# EAGLE design DTUnodeSchematic (EAGLE 8.0.0)

## Sheet 1 of 4
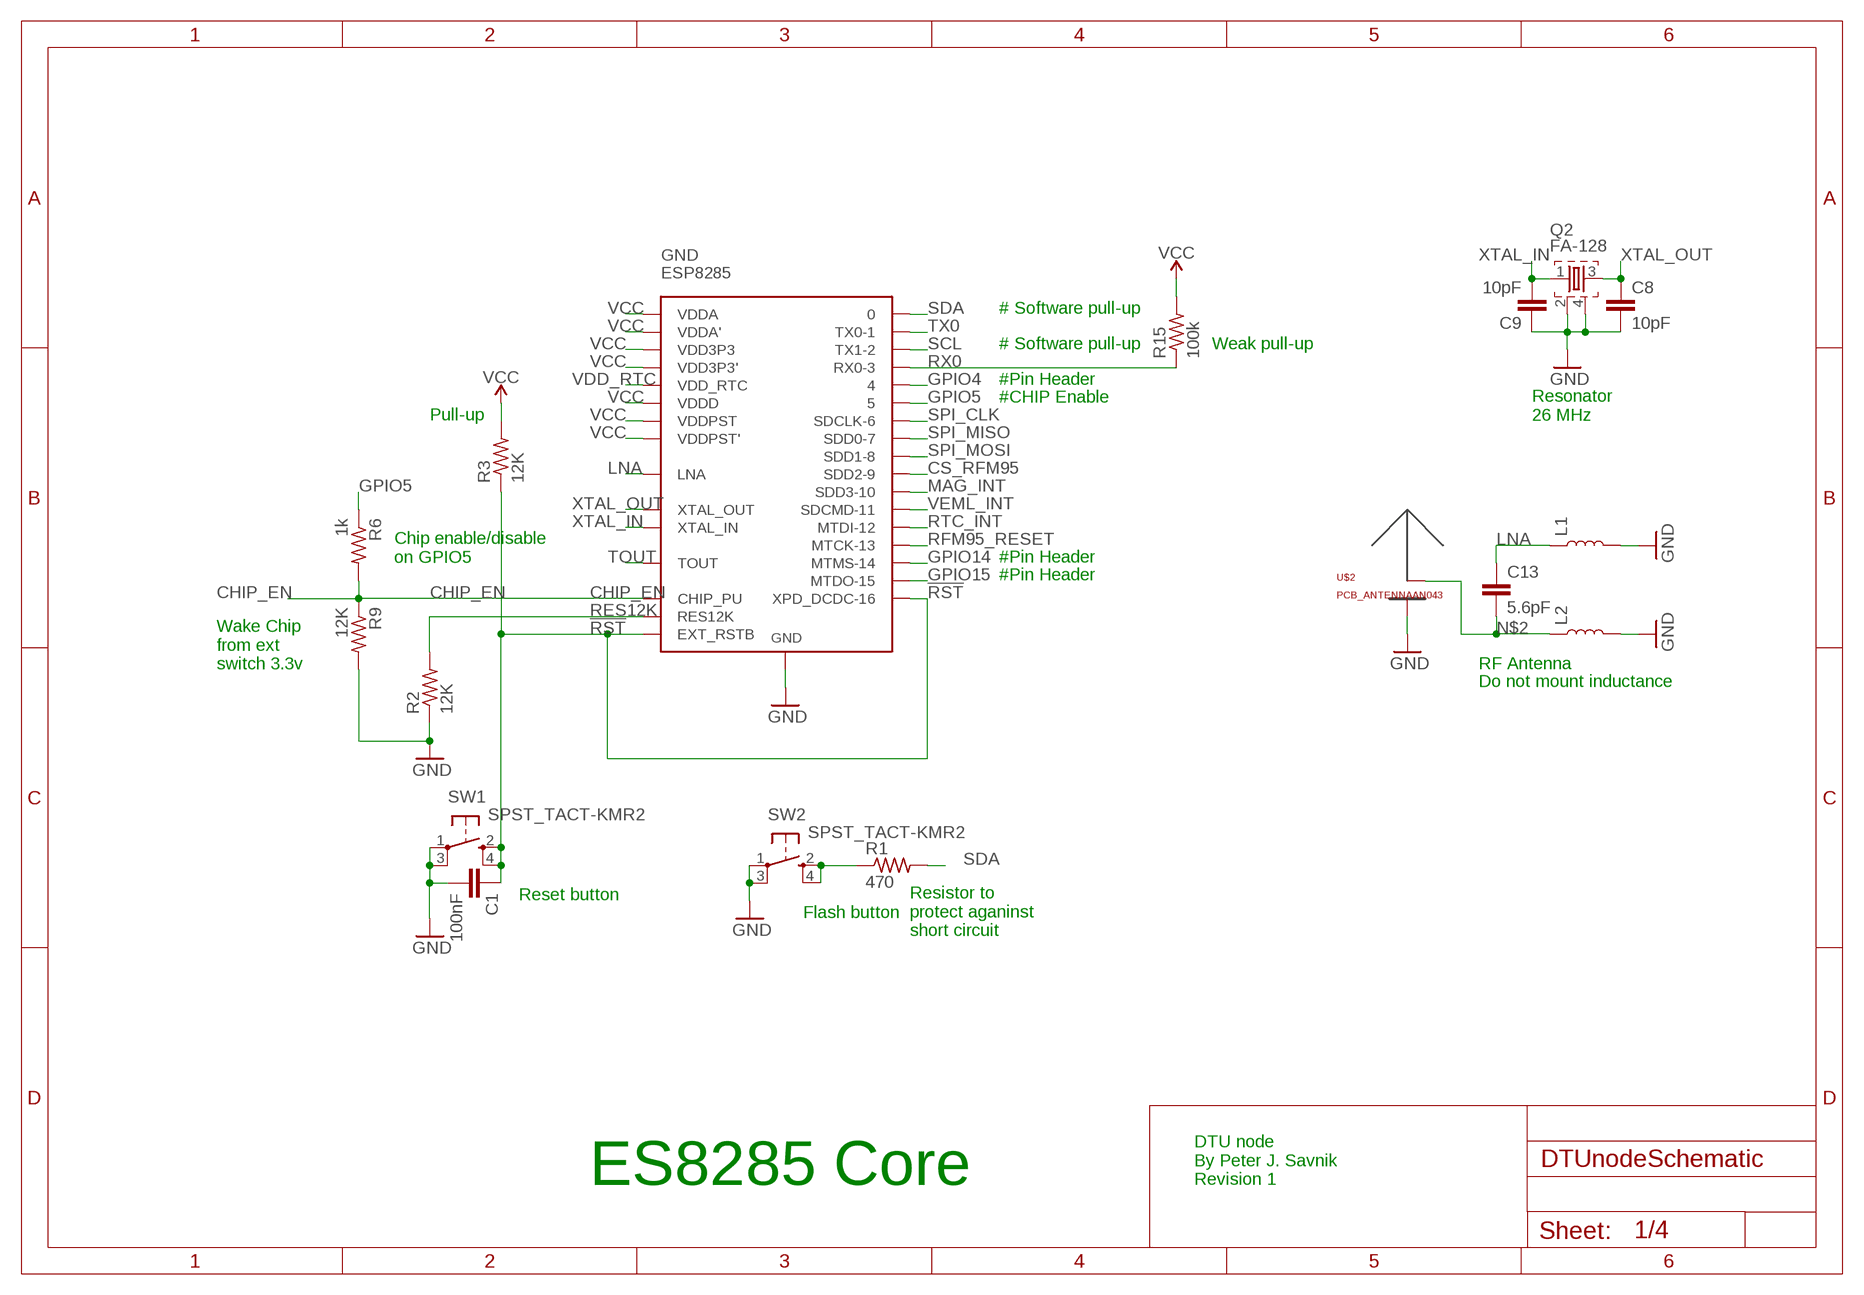
[diagram p0: schematic, sheet 1]

### Parts
C1  100nF  C-EUC0402K  [C0402K]
C8  10pF  C-EUC0402K  [C0402K]
C9  10pF  C-EUC0402K  [C0402K]
C13  5.6pF  C-EUC0402K  [C0402K]
GND  ESP8285  [QFN-32]
L1  INDUCTOR-0402-3.9NH  [0402]
L2  INDUCTOR-0402-3.9NH  [0402]
Q2  FA-128  [FA-128]
R1  470  R-US_R0402  [R0402]
R2  12K  R-US_R0402  [R0402]
R3  12K  R-US_R0402  [R0402]
R6  1k  R-US_R0402  [R0402]
R9  12K  R-US_R0402  [R0402]
R15  100k  R-US_R0402  [R0402]
SW1  SPST_TACT-KMR2  [KMR2]
SW2  SPST_TACT-KMR2  [KMR2]
U$2  PCB_ANTENNAAN043  [PCB_ANTENNA_TI-AN043]

### Nets
!RST: C1.1 GND.P$8(XPD_DCDC-16) GND.P$32(EXT_RSTB) R3.1 SW1.2(S) SW1.4(S1) ; also sheet 3
CHIP_EN: GND.P$7(CHIP_PU) R6.2 R9.1 ; also sheet 4
CS_RFM95: GND.P$18(SDD2-9) ; also sheet 3
GND: C1.2 C8.2 C9.1 GND.33-GND(GND) L1.2 L2.2 Q2.2 Q2.4 R2.1 R9.2 SW1.1(P) SW1.3(P1) SW2.1(P) SW2.3(P1) U$2.GND ; also sheet 2,3,4
GPIO4: GND.P$16 ; also sheet 4
GPIO5: GND.P$24 R6.1
GPIO14: GND.P$9(MTMS-14) ; also sheet 4
GPIO15: GND.P$13(MTDO-15) ; also sheet 4
LNA: C13.1 GND.P$2(LNA) L1.1
MAG_INT: GND.P$19(SDD3-10) ; also sheet 3
N$1: R1.1 SW2.2(S) SW2.4(S1)
N$2: C13.2 L2.1 U$2.ANT(AND)
RES12K: GND.P$31(RES12K) R2.2
RFM95_RESET: GND.P$12(MTCK-13) ; also sheet 3
RTC_INT: GND.P$10(MTDI-12) ; also sheet 3
RX0: GND.P$25(RX0-3) R15.1 ; also sheet 4
SCL: GND.P$14(TX1-2) ; also sheet 3,4
SDA: GND.P$15 R1.2 ; also sheet 3,4
SPI_CLK: GND.P$21(SDCLK-6) ; also sheet 3
SPI_MISO: GND.P$22(SDD0-7) ; also sheet 3
SPI_MOSI: GND.P$23(SDD1-8) ; also sheet 3
TOUT: GND.P$6(TOUT) ; also sheet 2
TX0: GND.P$26(TX0-1) ; also sheet 4
VCC: GND.P$1(VDDA) GND.P$3(VDD3P3) GND.P$4(VDD3P3') GND.P$11(VDDPST) GND.P$17(VDDPST') GND.P$29(VDDD) GND.P$30(VDDA') R3.2 R15.2 ; also sheet 2,3,4
VDD_RTC: GND.P$5(VDD_RTC)
VEML_INT: GND.P$20(SDCMD-11) ; also sheet 3
XTAL_IN: C9.2 GND.P$28(XTAL_IN) Q2.1
XTAL_OUT: C8.1 GND.P$27(XTAL_OUT) Q2.3

### Notes on the sheet
- # Software pull-up
- # Software pull-up | Weak pull-up
- #Pin Header
- #CHIP Enable
- Pull-up
- Resonator
  26 MHz
- Chip enable/disable
  on GPIO5
- #Pin Header
- #Pin Header
- Wake Chip 
  from ext
  switch 3.3v
- RF Antenna
- Do not mount inductance
- Reset button
- Flash button
- Resistor to 
  protect aganinst
  short circuit
- ES8285 Core
- DTU node
  By Peter J. Savnik
  Revision 1

## Sheet 2 of 4
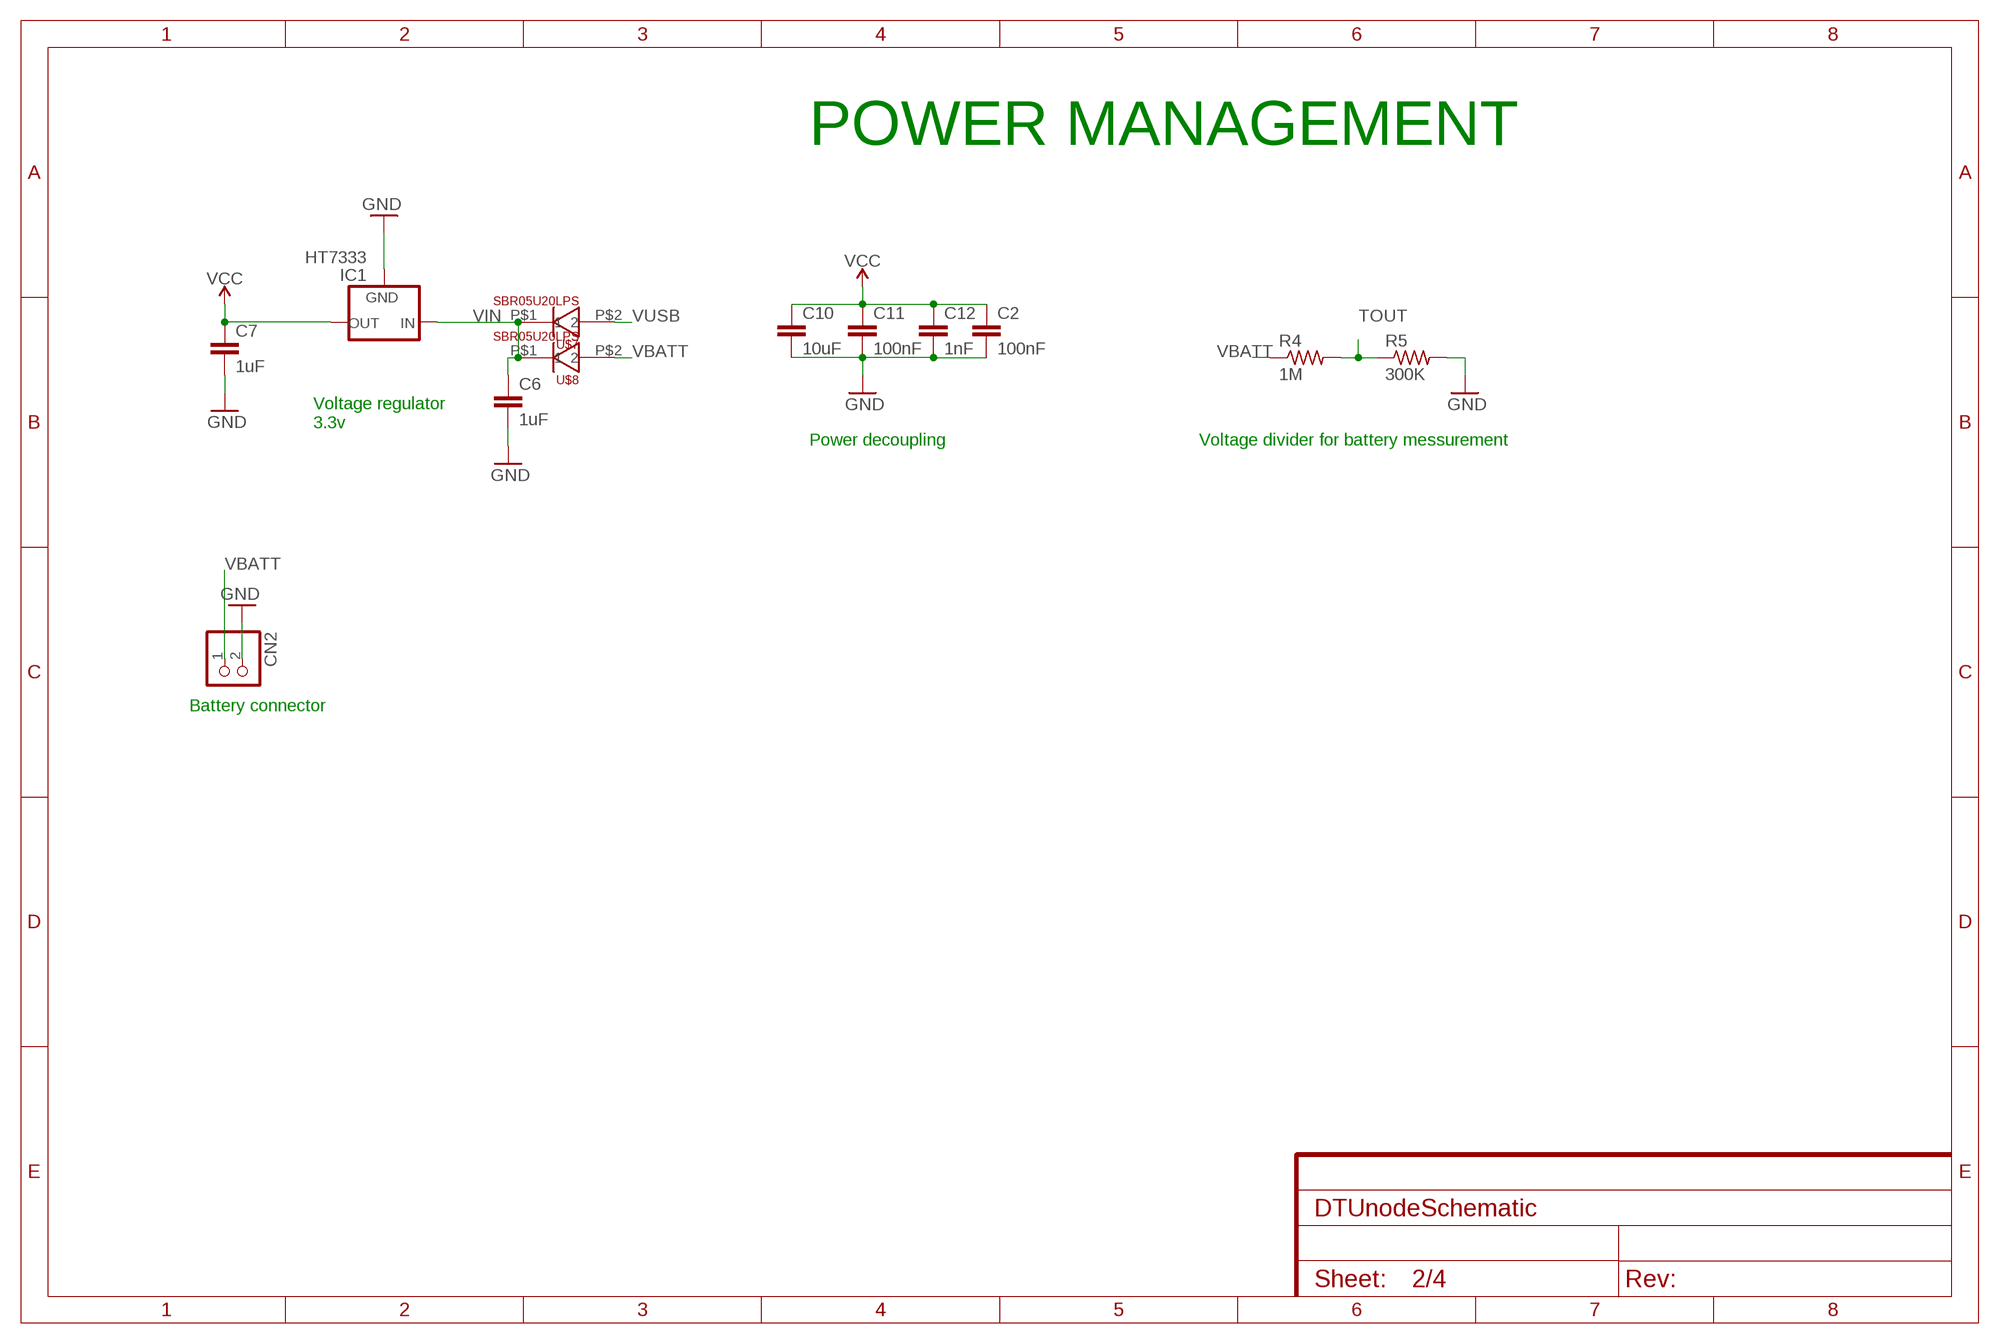
[diagram p1: schematic, sheet 2]

### Parts
C2  100nF  C-EUC0402K  [C0402K]
C6  1uF  C-EUC0402K  [C0402K]
C7  1uF  C-EUC0402K  [C0402K]
C10  10uF  C-EUC0402K  [C0402K]
C11  100nF  C-EUC0402K  [C0402K]
C12  1nF  C-EUC0402K  [C0402K]
CN2  JST_2PIN-THM-RA  [JST-PH-2-THM-RA]
IC1  HT7333  [SOT-89]
R4  1M  R-US_R0402  [R0402]
R5  300K  R-US_R0402  [R0402]
U$7  SBR05U20LPS  [X2-DFN1006-2]
U$8  SBR05U20LPS  [X2-DFN1006-2]

### Nets
GND: C2.2 C6.2 C7.2 C10.2 C11.2 C12.2 CN2.2 IC1.2(GND) R5.2 ; also sheet 1,3,4
TOUT: R4.2 R5.1 ; also sheet 1
VBATT: CN2.1 R4.1 U$8.P$2 ; also sheet 4
VCC: C2.1 C7.1 C10.1 C11.1 C12.1 IC1.1(OUT) ; also sheet 1,3,4
VIN: C6.1 IC1.3(IN) IC1.4(IN) U$7.P$1 U$8.P$1
VUSB: U$7.P$2 ; also sheet 4

### Notes on the sheet
- POWER MANAGEMENT
- Voltage regulator
  3.3v
- Power decoupling | Voltage divider for battery messurement
- Battery connector

## Sheet 3 of 4
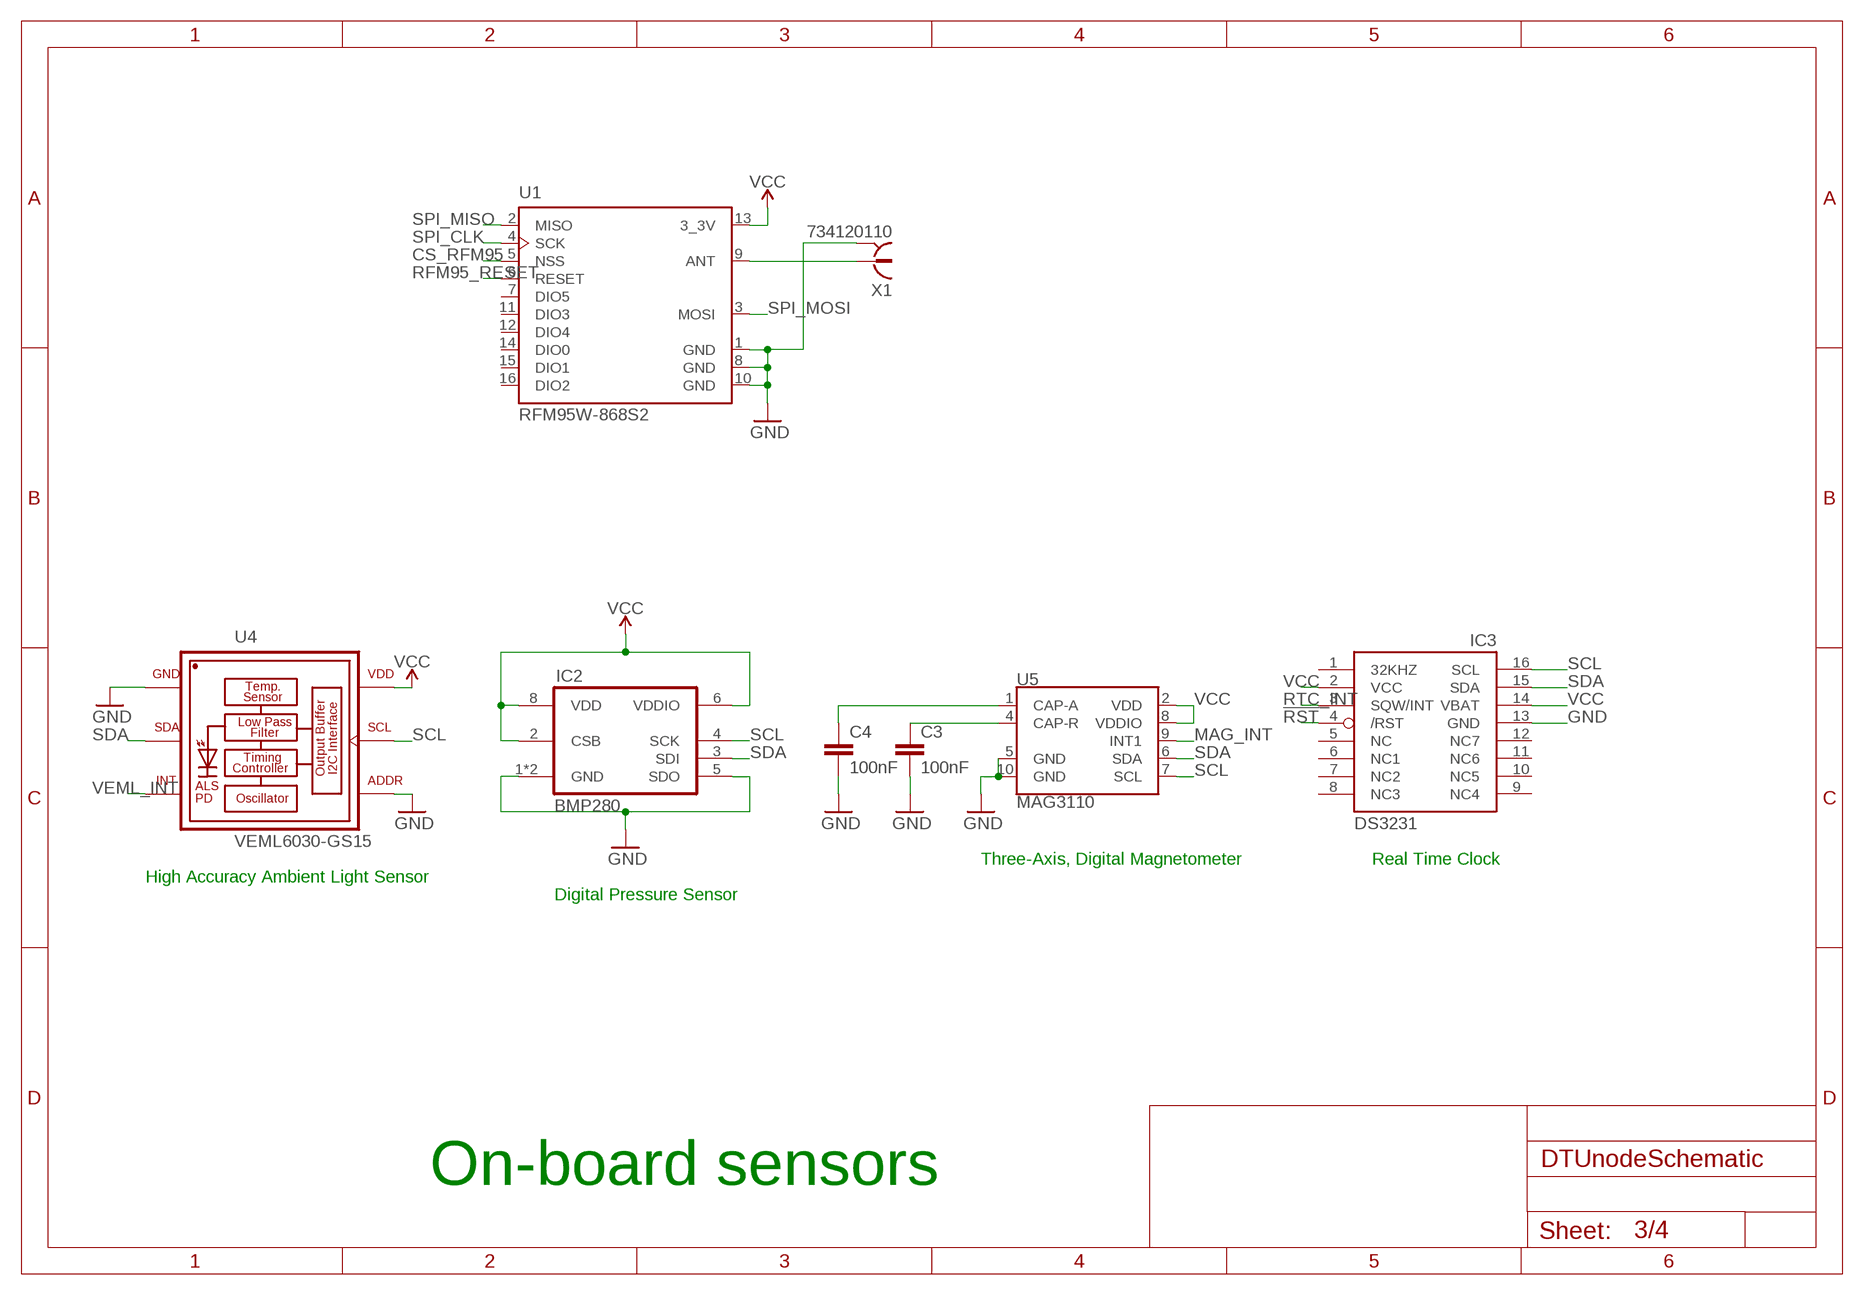
[diagram p2: schematic, sheet 3]

### Parts
C3  100nF  C-EUC0402  [C0402]
C4  100nF  C-EUC0402  [C0402]
IC2  BMP280  [BMP280]
IC3  DS3231/SO  [SO16W]
U1  RFM95W-868S2  [XCVR_RFM95W-868S2]
U4  VEML6030-GS15  [VISHAY_VEML6030_2X2X0.87]
U5  MAG3110  [DFN-10]
X1  734120110  [734120110]

### Nets
!RST: IC3.4(/RST) ; also sheet 1
CS_RFM95: U1.5(NSS) ; also sheet 1
GND: C3.2 C4.2 IC2.1(GND) IC2.5(SDO) IC2.7(GND) IC3.13(GND) U1.1(GND) U1.8(GND) U1.10(GND) U4.1(GND) U4.4(ADDR) U5.5(GND) U5.10(GND) X1.S@1 X1.S@2 X1.S@3 ; also sheet 1,2,4
MAG_INT: U5.9(INT1) ; also sheet 1
N$3: U1.9(ANT) X1.1
N$9: C3.1 U5.4(CAP-R)
N$10: C4.1 U5.1(CAP-A)
RFM95_RESET: U1.6(RESET) ; also sheet 1
RTC_INT: IC3.3(SQW/INT) ; also sheet 1
SCL: IC2.4(SCK) IC3.16(SCL) U4.5(SCL) U5.7(SCL) ; also sheet 1,4
SDA: IC2.3(SDI) IC3.15(SDA) U4.2(SDA) U5.6(SDA) ; also sheet 1,4
SPI_CLK: U1.4(SCK) ; also sheet 1
SPI_MISO: U1.2(MISO) ; also sheet 1
SPI_MOSI: U1.3(MOSI) ; also sheet 1
VCC: IC2.2(CSB) IC2.6(VDDIO) IC2.8(VDD) IC3.2(VCC) IC3.14(VBAT) U1.13(3_3V) U4.6(VDD) U5.2(VDD) U5.8(VDDIO) ; also sheet 1,2,4
VEML_INT: U4.3(INT) ; also sheet 1
Unconnected: IC3.1(32KHZ) IC3.5(NC) IC3.6(NC1) IC3.7(NC2) IC3.8(NC3) IC3.9(NC4) IC3.10(NC5) IC3.11(NC6) IC3.12(NC7) U1.7(DIO5) U1.11(DIO3) U1.12(DIO4) U1.14(DIO0) U1.15(DIO1) U1.16(DIO2)

### Notes on the sheet
- Three-Axis, Digital Magnetometer | Real Time Clock
- High Accuracy Ambient Light Sensor
- Digital Pressure Sensor
- On-board sensors

## Sheet 4 of 4
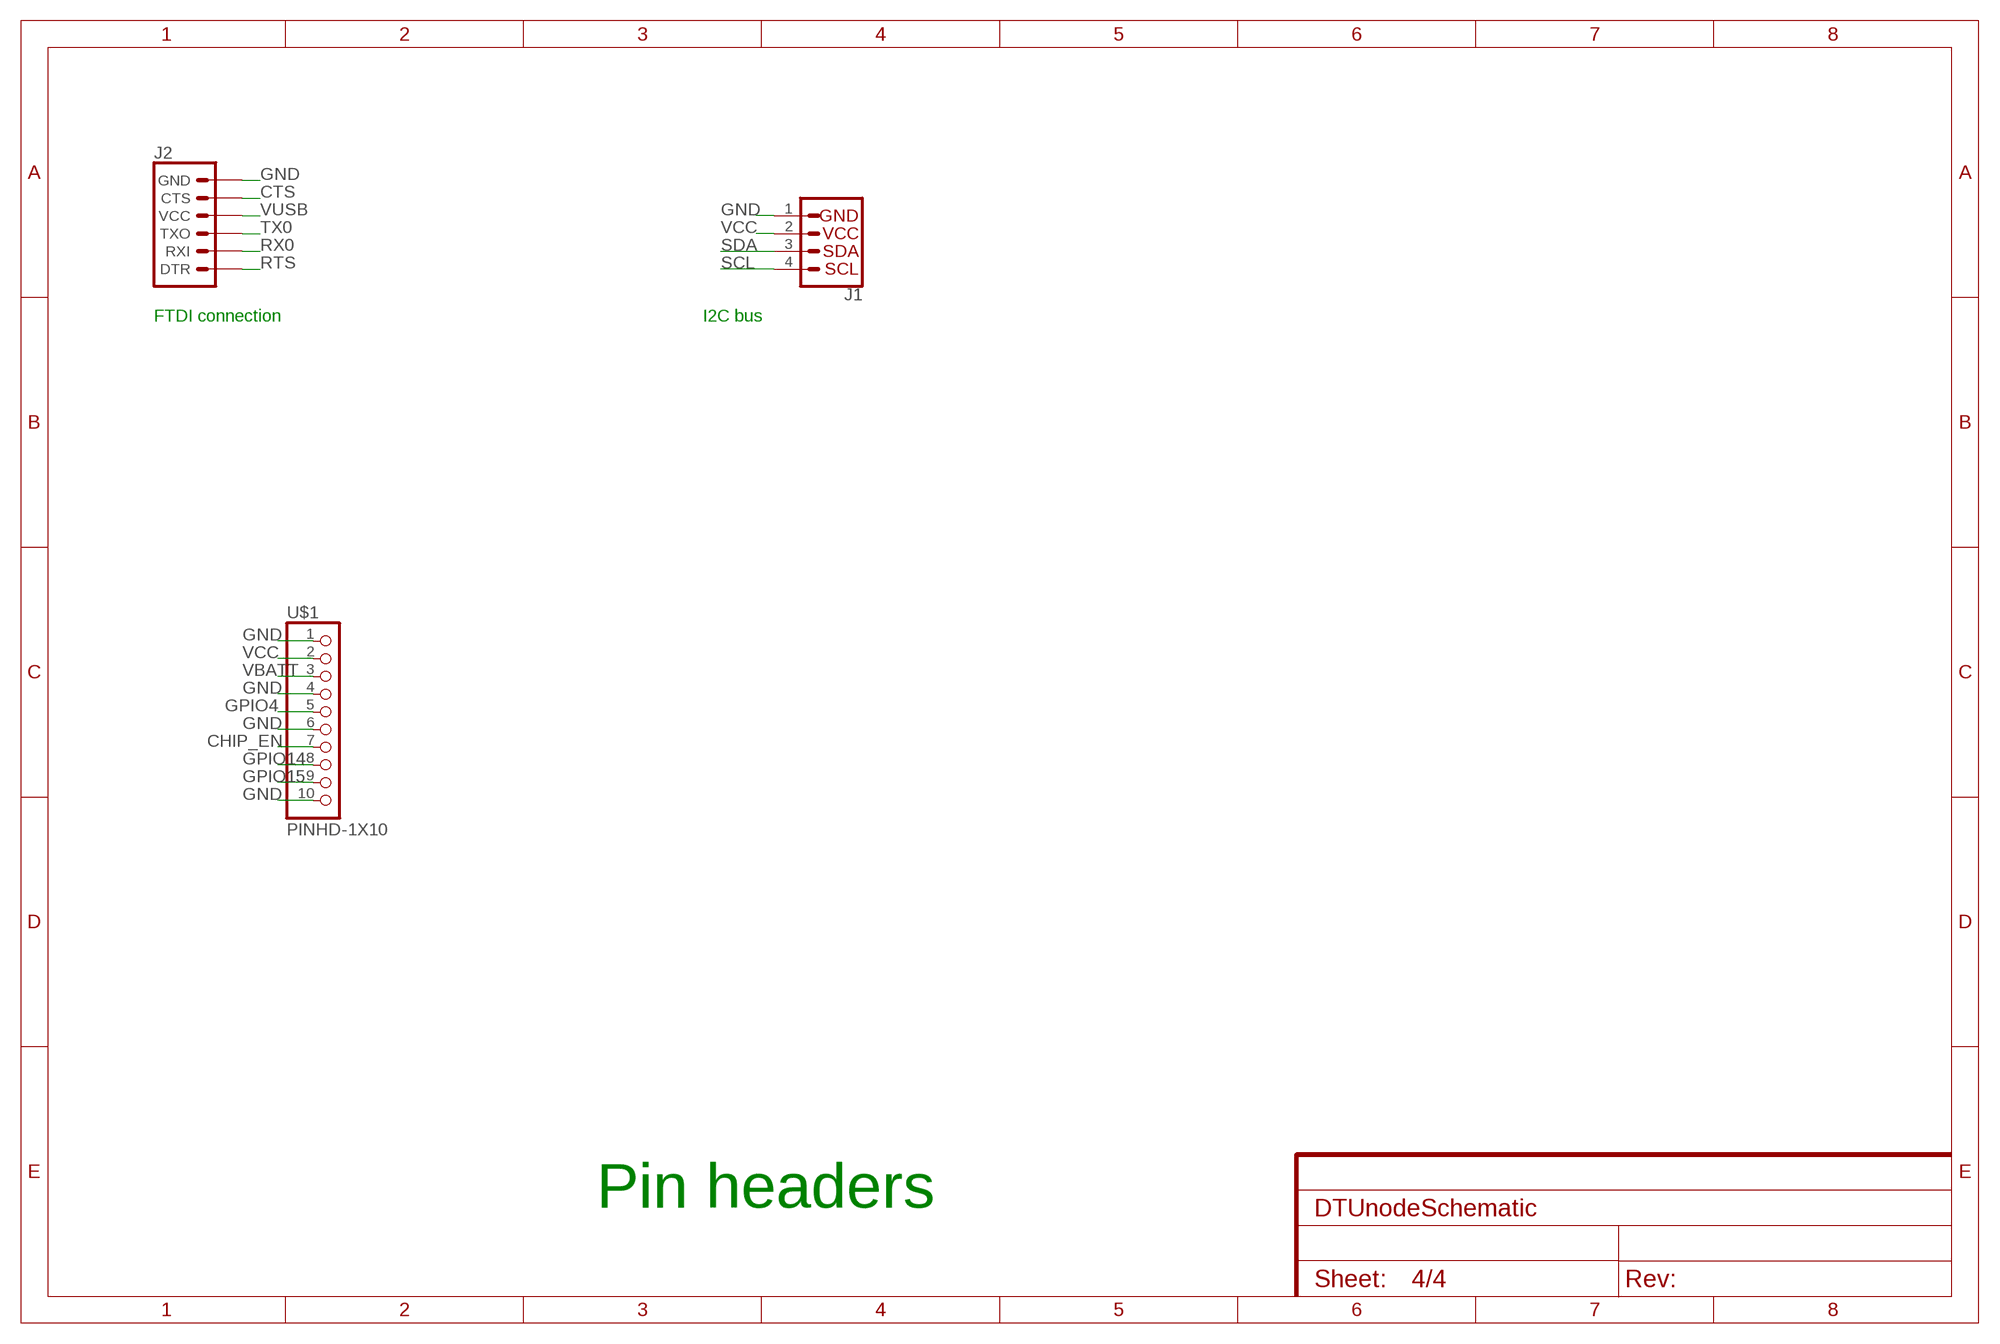
[diagram p3: schematic, sheet 4]

### Parts
J1  I2C_STANDARD  [1X04]
J2  6_PIN_SERIAL_TARGET  [1X06]
U$1  PINHD-1X10  [1X10-BIG]

### Nets
CHIP_EN: U$1.7 ; also sheet 1
CTS: J2.5(CTS)
GND: J1.1 J2.6(GND) U$1.1 U$1.4 U$1.6 U$1.10 ; also sheet 1,2,3
GPIO4: U$1.5 ; also sheet 1
GPIO14: U$1.8 ; also sheet 1
GPIO15: U$1.9 ; also sheet 1
RTS: J2.1(DTR)
RX0: J2.2(RXI) ; also sheet 1
SCL: J1.4 ; also sheet 1,3
SDA: J1.3 ; also sheet 1,3
TX0: J2.3(TXO) ; also sheet 1
VBATT: U$1.3 ; also sheet 2
VCC: J1.2 U$1.2 ; also sheet 1,2,3
VUSB: J2.4(VCC) ; also sheet 2

### Notes on the sheet
- FTDI connection | I2C bus
- Pin headers

## Library data of the parts
C1 C2 C6-C13 = resistor:C-EU: CAPACITOR, European symbol; OC_FARNELL: unknown
C3 C4 = resistor:C-EU: CAPACITOR, European symbol
CN2 = adafruit:JST_2PIN: JST 2-Pin Connectors of various flavors SMT-RA (S2B-PH-SM4) 4UConnector #17311 SMT (B2B-PH-SM4) THM-RA (S2B-PH) THM (B2B-PH); OC_FARNELL: unknown
GND = Ma-ESP8285:ESP8285: ESP8285 Microcontroller with wifi and 1M flash by Espressif; OC_FARNELL: unknown
IC1 = holtek2:HT73*
IC2 = bosch-bmp280:BMP280: The BMP280 is an absolute barometric pressure sensor especially designed for mobile applications. The sensor module is housed in an extremely compact 8-pin metal-lid LGA package with a footprint of only 2.0 × 2.5 mm2 and 0.95 mm package height. Its small dimensions and its low power consumption of 2.7 μA @1Hz allow the implementation in battery driven devices such as mobile phones, GPS modules or watches. The library has been designed by Richard Magdycz <https://www.facebook.com/groups/eaglecadsoftUK>
IC3 = adafruit:DS3231
J1 = SparkFun-Connectors:I2C_STANDARD: SparkFun I2C Standard Pinout Header SparkFun has standardized on a pinout for all I2C based sensor breakouts. This pinout allows I2C boards to be plugged directly into the headers on Arduino Uno compatible boards, and to be daisy chained easily. Example SparkFun Products: SparkFun Atmospheric Sensor Breakout - BME280 <https://www.sparkfun.com/products/13676> SparkFun Altitude/Pressure Sensor Breakout - MPL3115A2 <https://www.sparkfun.com/products/11084> SparkFun TOF Range Finder Sensor - VL6180 <https://www.sparkfun.com/products/12785>
J2 = SparkFun-Connectors:6_PIN_SERIAL_TARGET: 6-pin header connection for use with the "FTDI BASIC" pinout - TARGET SIDE. Also known as "Arduino Serial Program Header". It is used to mate with our FTDI Basic serial programmers using the Arduino IDE. Note, this device has "TARGET" in the name. It is intended to be used on a design that contains a target micro-controller that you wish to program. The "sister" device, named "CABLE" is inteneded to be used on a design that usually lives on the end of your USB cable and prvides the converter chip (FTDI232 or FTDI231x) to commnicate serial RX/TX. You can populate with some of these: Break Away Headers - Straight <https://www.sparkfun.com/products/116> (PRT-00116) For reference (or to suit your programming needs) check out these designs: SparkFun FTDI Basic Breakout - 5V <https://www.sparkfun.com/products/9716> (DEV-09716) SparkFun FTDI Basic Breakout - 3.3V <https://www.sparkfun.com/products/9873> (DEV-09873) SparkFun FTDI SmartBasic <https://www.sparkfun.com/products/12935> (DEV-12935) SparkFun Beefy 3 - FTDI Basic Breakout <https://www.sparkfun.com/products/13746> (DEV-13746)
L1 L2 = SparkFun-Coils:INDUCTOR: Inductors Resist changes in electrical current. Basically a coil of wire. SparkFun Products: SparkFun Load Cell Amplifier - HX711 <https://www.sparkfun.com/products/13879> IOIO-OTG - V2.2 <https://www.sparkfun.com/products/13613>; OC_FARNELL: unknown; PROD_ID: NDUC-13457; VALUE: 3.9NH
Q2 = crystal:FA-: MHz RANGE CRYSTAL UNIT Source: Epson Toyocom; OC_FARNELL: unknown
R1-R6 R9 R15 = resistor:R-US_: RESISTOR, American symbol; OC_FARNELL: unknown
SW1 SW2 = adafruit:SPST_TACT: SMT 6mm switch, EVQQ2 series http://www.ladyada.net/library/eagle
U1 = RFM95W-868S2:RFM95W-868S2: Mod Txrx Lora +20dbm 868mhz Smd; AVAILABILITY: Unavailable; MF: Hope Microelectronics; MP: RFM95W-868S2; PACKAGE: SMD-16 Hope Microelectronics; PRICE: 9.47 USD
U4 = VEML6030-GS15:VEML6030-GS15: VEML6030 High Accuracy Ambient Light Sensor with I2C Interface: VEML6030 is a high accuracy ambient light digital 16-bit resolution sensor in a miniature transparent 2 mm x 2 mm package. It includes a high sensitive photodiode, a low noise amplifier, a 16-bit A/D converter and supports an easy to use I2C bus communication interface and additional interrupt feature. The ambient light result is as digital value available. Device Model created 15.06.2016 by Johannes Kolb - Vishay Semiconductor GmbH; AVAILABILITY: Good; DESCRIPTION: High Accuracy Ambient Light Sensor With I2c Interface; MF: Vishay Semiconductor; MP: VEML6030-GS15; PACKAGE: None; PRICE: 1.46 USD
U5 = SparkFun-Sensors:MAG3110: Freescale MAG3110 3-Axis Digital (I2C) Magnetometer Freescale’s MAG3110 is a small, low-power, digital 3-axis magnetometer. The device can be used in conjunction with a 3-axis accelerometer to produce orientation independent accurate compass heading information. It features a standard I2C serial interface output and smart embedded functions. Datasheet <https://cdn.sparkfun.com/datasheets/Sensors/Magneto/MAG3110_v9.2.pdf> SparkFun Products SparkFun Triple Axis Magnetometer Breakout - MAG3110 <https://www.sparkfun.com/products/12670> (SEN-12670); PROD_ID: IC-10404
U$1 = adafruit:PINHD-1X10: Pin header 1x10 0.1" spacing With round pins
U$2 = Ma-ESP8285:PCB_ANTENNA: PCB Antennas for Wifi Two models are provided, both from Texas Instruments design/application notes See also http://hackaday.com/2014/02/28/pcb-antenna-reference-designs/
U$7 U$8 = Diodes_Inc_By_element14_Batch_1:SBR05U20LPS: SURFACE MOUNT SUPER BARRIER RECTIFIER Ultra-Low Forward Voltage Drop Superior Reverse Avalanche Capability Patented Super Barrier Rectifier Technology Soft, Fast Switching Capability +150°C Operating Junction Temperature Totally Lead-Free & Fully RoHS Compliant (Notes 1 & 2) Halogen and Antimony Free. “Green” Device (Note 3); OC_FARNELL: unknown
X1 = con-coax:734120110: MICRO COAXIAL CONNECTOR RECEPTACLE VERTICAL Source: Data sheet <http://www.molex.com/pdm_docs/sd/734120110_sd.pdf>

## Board
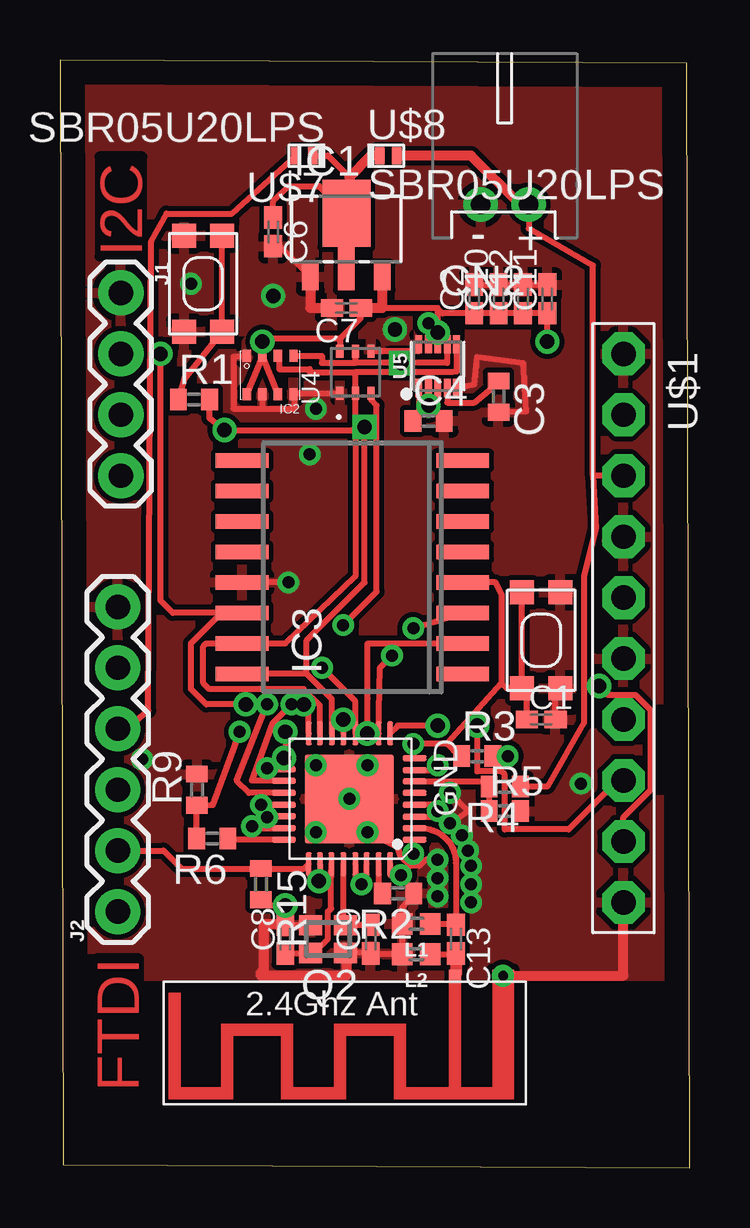
[diagram p4: board, top side]
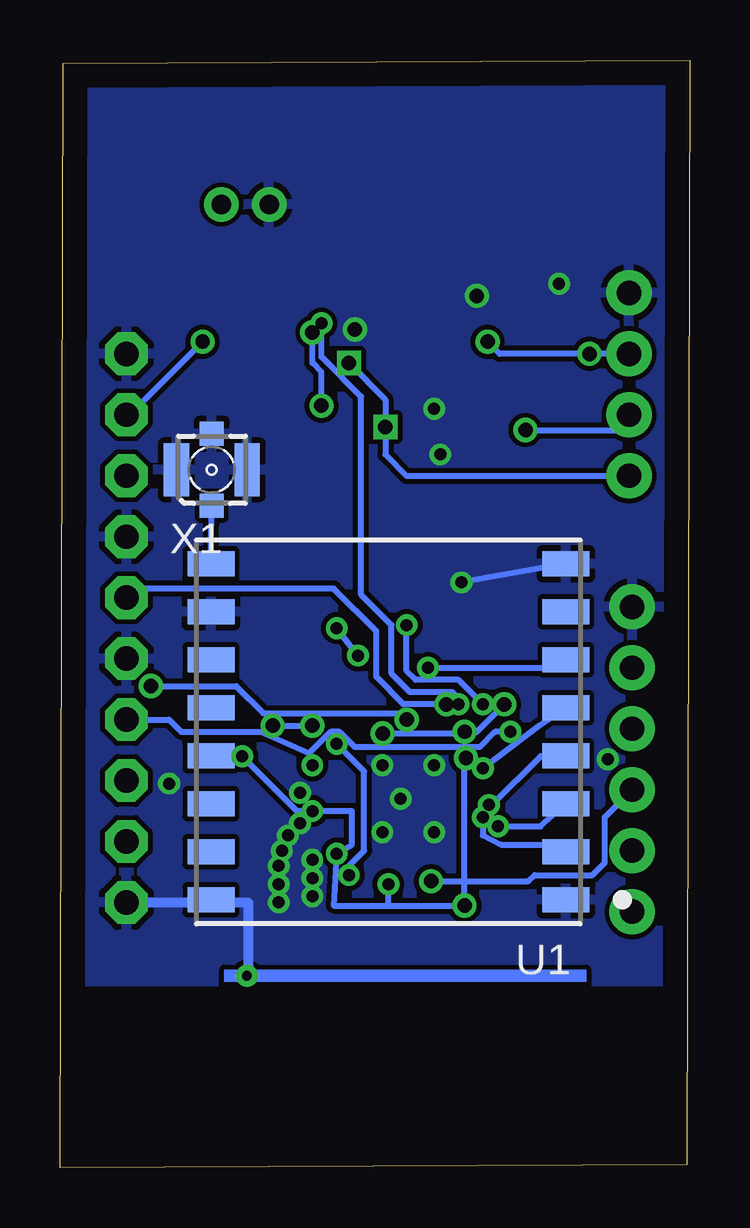
[diagram p5: board, bottom side, seen from below]

Size 26.27 x 46.15 mm. Coordinates in mm from the lower left corner, seen from the top.
Outline: 0.13,0.13 26.27,0 26.14,46.03 0,46.15 0.13,0.13
Copper layers (1*16): Top 0.035mm / dielectric 1.5mm / Bottom 0.035mm
Design rules "default": minimum track width 10mil, minimum drill 24mil, track to track 8mil, track to pad 8mil, pad to pad 8mil, via to via 8mil, smd to smd 8mil, copper to edge 40mil, drill to drill 8mil, minimum pad ring 10mil, minimum via ring 8mil, stop-mask expansion 4mil, vias tented up to drill 0mil, thermal gap 10mil

### Footprints (pad centres in the part's own frame; a part is rotated, then mirrored left to right if it is on the bottom)
C0402K = smd 0.925 x 0.74: 1 -0.6,0; 2 0.6,0
C0402 = smd 0.7 x 0.9: 1 -0.65,0; 2 0.65,0
JST-PH-2-THM-RA = drill 0.8 pad 1.422: 1 1,0; 2 -1,0
QFN-32 = smd 3.7 x 3.7: 33-GND 0,0 | smd 0.25 x 1: P$1 1.7,2.725; P$2 1.225,2.725; P$3 0.75,2.725; P$4 0.25,2.725; P$5 -0.25,2.725; P$6 -0.725,2.725; P$7 -1.2,2.725; P$8 -1.7,2.725; P$17 -1.7,-2.725; P$18 -1.225,-2.725; P$19 -0.75,-2.725; P$20 -0.25,-2.725; P$21 0.25,-2.725; P$22 0.725,-2.725; P$23 1.225,-2.725; P$24 1.7,-2.725 | smd 1 x 0.25: P$9 -2.725,1.7; P$10 -2.725,1.225; P$11 -2.725,0.75; P$12 -2.725,0.25; P$13 -2.725,-0.25; P$14 -2.725,-0.725; P$15 -2.725,-1.225; P$16 -2.725,-1.7; P$25 2.725,-1.7; P$26 2.725,-1.225; P$27 2.725,-0.75; P$28 2.725,-0.25; P$29 2.725,0.25; P$30 2.725,0.725; P$31 2.725,1.225; P$32 2.725,1.7
SOT-89 = smd 0.7 x 1.1: 1 1.5,-2.385; 2 -1.5,-2.385 | smd 0.7 x 1.8: 3 0,-2.035 | smd 2 x 2.8: 4 0,0.265
BMP280 = smd 0.35 x 0.5: 1 0.975,-0.8; 2 0.325,-0.8; 3 -0.325,-0.8; 4 -0.975,-0.8; 5 -0.975,0.8; 6 -0.325,0.8; 7 0.325,0.8; 8 0.975,0.8
SO16W = smd 0.6 x 2.2: 1 -4.445,-4.6; 2 -3.175,-4.6; 3 -1.905,-4.6; 4 -0.635,-4.6; 5 0.635,-4.6; 6 1.905,-4.6; 7 3.175,-4.6; 8 4.445,-4.6; 9 4.445,4.6; 10 3.175,4.6; 11 1.905,4.6; 12 0.635,4.6; 13 -0.635,4.6; 14 -1.905,4.6; 15 -3.175,4.6; 16 -4.445,4.6
1X04 = drill 1.016 pad 1.88: 1 0,0; 2 2.54,0; 3 5.08,0; 4 7.62,0
1X06 = drill 1.016 pad 1.88: 1 0,0; 2 2.54,0; 3 5.08,0; 4 7.62,0; 5 10.16,0; 6 12.7,0
0402 = smd 0.85 x 0.9: 1 -0.58,0; 2 0.58,0
FA-128 = smd 0.95 x 0.85: 1 -0.725,-0.575; 2 0.725,-0.575; 3 0.725,0.575; 4 -0.725,0.575
R0402 = smd 0.7 x 0.9: 1 -0.65,0; 2 0.65,0
KMR2 = smd 1 x 1: 1 2,0.8; 2 2,-0.8; 3 -2,0.8; 4 -2,-0.8
XCVR_RFM95W-868S2 = smd 1.95 x 1.05: 1 -7.4,7; 2 -7.4,5; 3 -7.4,3; 4 -7.4,1; 5 -7.4,-1; 6 -7.4,-3; 7 -7.4,-5; 8 -7.4,-7; 9 7.4,-7; 10 7.4,-5; 11 7.4,-3; 12 7.4,-1; 13 7.4,1; 14 7.4,3; 15 7.4,5; 16 7.4,7
VISHAY_VEML6030_2X2X0.87 = smd 0.55 x 0.3: 1 -0.875,0.65; 2 -0.875,0; 3 -0.875,-0.65; 4 0.875,-0.65; 5 0.875,0; 6 0.875,0.65
DFN-10 = smd 0.762 x 0.279: 1 -0.91,0.787; 2 -0.91,0.381; 3 -0.91,0; 4 -0.91,-0.406; 5 -0.91,-0.787; 6 0.91,-0.787; 7 0.91,-0.406; 8 0.91,0; 9 0.91,0.381; 10 0.91,0.787
1X10-BIG = drill 1.016 pad 1.778 octagon: 1 -11.43,0; 2 -8.89,0; 3 -6.35,0; 4 -3.81,0; 5 -1.27,0; 6 1.27,0; 7 3.81,0; 8 6.35,0; 9 8.89,0; 10 11.43,0
PCB_ANTENNA_TI-AN043 = smd 0.5 x 0.5: ANT -3.9,-2.79 | smd 0.9 x 0.5: GND -5.9,-2.79 | drill 0.4: GND-PAD1 -5.9,-2.79
X2-DFN1006-2 = smd 0.4 x 0.7: P$1 0,0; P$2 0.7,0
734120110 = smd 1 x 1: 1 0,-1.5; S@1 0,1.5 | smd 1.05 x 2.2: S@2 -1.475,0; S@3 1.475,0

### Placement (x,y rotation side)
C1  20.07,18.67 0 top
C2  17.27,36.2 90 top
C3  18.29,32.13 270 top
C4  15.37,31.11 0 top
C6  8.89,38.99 270 top
C7  11.94,35.81 180 top
C8  9.4,9.53 90 top
C9  12.95,9.53 90 top
C10  18.29,36.2 90 top
C11  20.32,36.2 90 top
C12  19.3,36.2 90 top
C13  16.51,9.53 270 top
CN2  18.54,40.13 0 top
GND  12.07,15.37 270 top
IC1  11.94,39.5 0 top
IC2  8.76,33.02 180 top
IC3  12.19,25.02 90 top
J1  2.54,36.45 270 top
J2  2.41,10.67 90 top
L1  14.86,10.16 180 top
L2  14.86,8.89 180 top
Q2  11.18,9.53 180 top
R1  5.59,32 0 top
R2  14.1,11.43 180 top
R3  17.4,17.14 0 top
R4  18.54,15.88 180 top
R5  18.54,14.86 0 top
R6  6.35,13.72 180 top
R9  5.71,15.75 90 top
R15  8.38,11.81 270 top
SW1  20.07,21.97 270 top
SW2  5.97,36.83 90 top
U1  12.57,18.16 180 bottom
U4  12.32,33.15 90 top
U5  15.75,33.4 90 top
U$1  23.5,22.48 270 top
U$2  12.57,5.21 180 top
U$7  10.54,42.16 180 top
U$8  13.34,42.16 0 top
X1  19.94,29.08 0 bottom

### Tracks (layer width: path | path; a pad name or v marks a point on that pad's centre or on a via)
!RST  (via drill 0.5)
  Top 0.254: GND.P$32 13.77,12.19 v14.22,12.19 | GND.P$8 14.73,17.12 v14.73,17.65 16.13,17.65 | 18.41,20.19 16.13,17.65 | 18.41,20.19 18.41,23.88 18.16,24.38 IC3.4 | SW1.2 SW1.4 | SW1.2 18.64,19.97 18.41,20.19 | C1.1 19.47,19.9 SW1.2 | R3.1 16.64,17.14 16.13,17.65
  Bottom 0.254: v14.22,12.19 14.22,12.57 13.59,13.21 13.59,16.51 v14.73,17.65
CHIP_EN  (via drill 0.5)
  Top 0.254: GND.P$7 15.55,16.57 v15.75,16.76 | v7.49,18.16 6.37,15.11 R9.1 5.7,15.08 R6.2
  Bottom 0.254: 15.88,17.27 v15.75,16.76 | 15.88,17.27 14.99,18.16 14.61,18.16 13.97,17.53 8.76,17.53 8.13,18.16 v7.49,18.16 | U$1.7 21.72,18.67 21.21,18.16 17.91,18.16 15.88,17.27
CS_RFM95  (via drill 0.5)
  Top 0.254: GND.P$18 8.94,16.59 v8.64,16.64
  Bottom 0.254: v8.64,16.64 6.3,18.41 U1.5
GND  (via drill 0.5, 0.6)
  Top 0.254: Q2.2 9.42,10.1 C8.2 | Q2.4 12.93,8.95 C9.1 12.99,8.89 L2.2 L1.2 14.28,10.84 R2.1 | 8.44,31.62 IC2.7 | 8.44,31.62 9.78,31.62 9.78,32.22 IC2.5 9.74,32.27 U4.1 | IC2.1 7.79,33.78 7.24,33.78 7.24,31.62 8.44,31.62 | 12.95,34.02 U4.4 14.96,34.02 U5.10 | C1.2 20.67,19.9 SW1.1 | C6.2 9.16,38.39 IC1.2 | C2.2 C10.2 C12.2 C11.2 | v15.75,12.83 15.24,12.83 14.99,12.57 14.61,12.57 14.22,12.95 14.1,13.34 v12.83,13.97 | v9.53,24.38 IC3.13 | U5.5 17.27,32.64 17.4,33.78 19.3,33.53 19.43,31.5 C3.2 | v16.26,14.35 17.02,14.86 v16.26,15.62
  Top 0.406: C7.2 10.44,35.81 IC1.2 | U$2.GND 23.5,8 U$1.10 | Q2.4 11.94,8.95 11.94,8 8.38,8 8.38,8.13 8.51,8.13 8.51,10.16 9.4,10.16 C8.2
  Bottom 0.254: U1.8 v9.53,24.38
  Bottom 0.406: U$1.10 18.41,11.05 18.41,8
  other vias: 12.07,15.37 13.97,34.93 8.89,36.32 10.67,31.62 5.46,36.83 10.67,16.76 10.67,13.97 12.83,16.76 15.75,12.07 15.75,11.3 16.76,13.84 17.02,13.21 17.14,12.57 17.14,11.81 17.14,11.05 21.72,16 10.41,29.72 3.43,17.02
  pour Bottom: -0.89,7.75 28.19,7.75 28.19,50.16 -0.89,50.16
  pour Top: -2.03,8 28.83,8 28.83,51.05 -2.03,51.05
GPIO4  (via drill 0.6)
  Top 0.254: GND.P$16 10.37,19.1 v10.16,19.3
  Bottom 0.254: v10.16,19.3 11.94,19.3 13.08,20.45 13.08,22.35 14.86,24.13 23.11,24.13 U$1.5
GPIO5
  Top 0.254: GND.P$24 7.05,13.67 R6.1
GPIO14  (via drill 0.6)
  Top 0.254: U$1.8 23.24,16.13 21.21,14.1 18.54,14.1 18.54,16.38 18.41,16.51 17.4,16.51 v17.4,18.41 | v15.75,18.41 14.09,18.41 GND.P$9
  Bottom 0.254: v17.4,18.41 v15.75,18.41
GPIO15  (via drill 0.6)
  Top 0.254: U$1.9 23.5,14.61 24.64,15.75 24.64,19.05 24,19.68 22.86,19.68 v22.48,20.07 | v11.81,18.67 GND.P$13
  Bottom 0.254: v22.48,20.07 18.92,20.07 17.78,18.92 12.07,18.92 v11.81,18.67
LNA
  Top 0.254: L1.1 16.48,10.16 C13.1 16.51,12.7 arc90 15.07,14.14 GND.P$2
MAG_INT  (via drill 0.5)
  Top 0.254: GND.P$19 9.33,16.13 8,16.13 8.89,18.54 v9.65,19.3 | v15.37,35.18 U5.9 | U5.9
  Bottom 0.254: v9.65,19.3 9.65,19.56 9.91,19.81 11.68,19.81 12.45,20.57 12.45,22.61 13.72,23.88 13.72,32.13 15.37,33.78 v15.37,35.18
N$1
  Top 0.254: R1.1 5.19,32.87 SW2.4 SW2.2
N$2
  Top 0.254: L2.1 16.48,8.89 C13.2 | 16.51,8.03 U$2.ANT
  Top 0.508: C13.2 16.51,8.03
N$3
  Bottom 0.254: U1.9 19.97,25.84 X1.1
N$9
  Top 0.254: U5.4 16.15,31.88 17.27,31.88 17.91,32.39 C3.1
N$10
  Top 0.254: 14.99,32.34 U5.1 14.96,31.36 C4.1
RES12K
  Top 0.254: GND.P$31 13.29,11.46 R2.2
RFM95_RESET  (via drill 0.5)
  Top 0.254: GND.P$12 12.32,19.43 v10.92,20.83
  Bottom 0.254: v10.92,20.83 5.51,20.83 U1.6
RTC_INT  (via drill 0.5)
  Top 0.254: GND.P$10 13.34,20.83 v13.84,21.34 | v14.73,22.48 IC3.3
  Bottom 0.254: v13.84,21.34 v14.73,22.48
RX0
  Top 0.254: GND.P$25 10.18,12.46 R15.1 8.37,12.45 5.08,12.45 4.32,13.21 J2.2
SCL  (via drill 0.6)
  Top 0.254: GND.P$14 11.34,19.52 10.29,20.57 | 10.29,20.57 IC3.16 | U5.7 16.15,33.53 v14.22,33.53 12.32,33.53 | 12.32,33.53 U4.5 | IC2.4 10.92,33.82 10.92,33.53 12.32,33.53 | 10.29,20.57 10.29,21.97 12.7,24.38 v12.7,30.86
  Bottom 0.254: v14.22,33.53 12.7,32 v12.7,30.86 12.7,29.72 11.81,28.83 J1.4
SDA  (via drill 0.6)
  Top 0.254: GND.P$15 10.84,19.26 10.16,19.94 6.22,19.94 5.97,20.19 5.97,21.72 6.1,21.84 IC3.15 9.4,21.84 12.32,24.64 12.32,30.61 | U5.6 16.54,33.17 16.38,33.15 12.32,33.15 | 12.32,33.15 U4.2 12.32,30.61 | IC2.3 9.14,33.82 9.14,33.27 10.41,33.27 10.41,33.15 12.32,33.15 | R1.2 6.22,31.24 v6.86,30.73 12.19,30.73 12.32,30.61
  Bottom 0.254: v6.86,30.73 2.92,30.73 J1.3
SPI_CLK  (via drill 0.5)
  Top 0.254: GND.P$21 v8.39,15.12 v8.38,15.11
  Bottom 0.254: v8.38,15.11 8.26,15.11 6.22,17.14 5.19,17.14 U1.4
SPI_MISO  (via drill 0.5)
  Top 0.254: GND.P$22 8.67,14.64 v8.64,14.61
  Bottom 0.254: v8.64,14.61 8.64,13.84 7.87,13.46 5.25,13.46 U1.2
SPI_MOSI  (via drill 0.5)
  Top 0.254: 8.3,14.14 GND.P$23 8.05,14.14 v8,14.22
  Bottom 0.254: v8,14.22 6.24,14.22 U1.3
TOUT
  Top 0.254: GND.P$6 17.68,16.09 R4.2 R5.1
TX0  (via drill 0.6)
  Top 0.254: GND.P$26 10.84,11.98 v10.79,11.94
  Bottom 0.254: v10.79,11.94 6.73,11.94 6.48,12.19 4.06,12.19 3.56,12.7 3.56,14.61 J2.3
VBATT
  Top 0.254: CN2.1 19.54,39.13 22.23,37.59 22.23,28.83 | 22.23,28.83 22.35,26.67 21.84,24.64 21.84,18.54 20.32,15.88 R4.1 | U$1.3 22.23,28.83
  Top 0.406: CN2.1 19.18,40.13 17.14,42.16 U$8.P$2
VCC  (via drill 0.5, 0.6)
  Top 0.254: GND.P$3 15.75,14.62 v15.75,14.86 15.75,15.11 GND.P$4 | GND.P$29 12.32,11.81 v12.57,11.81 12.79,11.81 GND.P$30 | IC2.6 IC2.2 | IC2.2 IC2.8 | IC2.2 v8.44,34.42 8.44,34.54 11.68,34.54 | 11.68,34.54 11.68,34.02 U4.6 | GND.P$1 14.73,13.61 v14.73,13.08 | R3.2 v18.67,17.14 | 15.75,35.81 v15.75,34.8 U5.8 | 15.75,35.81 13.44,35.81 | C7.1 12.54,35.4 11.68,34.54 | 15.75,35.81 15.97,35.6 C2.1 C10.1 C12.1 C11.1 v20.32,34.42 | U5.2 v15.37,31.75 | v15.37,31.75 | v9.4,10.92 8.62,10.92 R15.2 | v9.4,18.16 9.4,17.12 GND.P$17 | v7.75,19.3 6.1,19.3 5.46,19.94 5.46,21.84 6.73,23.11 IC3.14 4.7,23.11 4.19,23.62 v4.19,33.91 | GND.P$11 12.83,19.56 12.83,21.84 IC3.2
  Top 0.406: C7.1 13.44,35.81 IC1.1
  Bottom 0.254: 12.57,10.92 14.86,10.92 v14.73,13.08 14.1,13.46 14.1,14.86 v15.75,14.86 16.38,14.86 v18.67,17.14 19.96,17.14 U1.13 | 12.57,10.92 v12.57,11.81 | J1.2 v4.19,33.91 7.93,33.91 v8.44,34.42 | v15.37,31.75 15.37,33.15 15.75,33.53 v15.75,34.8 | 12.57,10.92 v9.4,10.92 9.4,17.01 GND.P$17 | GND.P$11 9.47,18.09 v9.4,18.16 | v9.4,18.16 8.89,18.16 | v9.4,18.16 8.89,18.16 | 8.89,18.16 v7.75,19.3 | U$1.2 23.37,31.37 v20.32,34.42
  other vias: 9.34,17.07 12.82,18.09
VEML_INT  (via drill 0.5)
  Top 0.254: GND.P$20 7.88,15.62 7.37,16.13 v8.64,19.3 | v11.81,22.61 13.21,24 13.21,31.75 12.97,31.99 U4.3
  Bottom 0.254: v8.64,19.3 9.65,20.32 11.43,20.32 11.81,20.7 v11.81,22.61
VIN
  Top 0.254: IC1.4 10.81,40.89 9.53,40.89 8.89,40.26 C6.1 8.67,39.37 | U$7.P$1 11.18,42.16 12.07,41.28
  Top 0.406: U$8.P$1 12.95,42.16 12.07,41.28 12.07,39.89 IC1.4 IC1.3
VUSB
  Top 0.254: J2.4 2.79,18.29 3.68,19.05 3.81,38.61 4.45,39.75 7.17,39.75 U$7.P$2
XTAL_IN
  Top 0.254: C9.2 12.95,10.1 Q2.1 11.82,10.1 GND.P$28
XTAL_OUT
  Top 0.254: C8.1 10.45,8.93 Q2.3 10.6,8.95 11.18,9.53 11.18,10.67 11.3,10.79 11.3,12.12 GND.P$27

### Text on the board
Top: I2C | FTDI